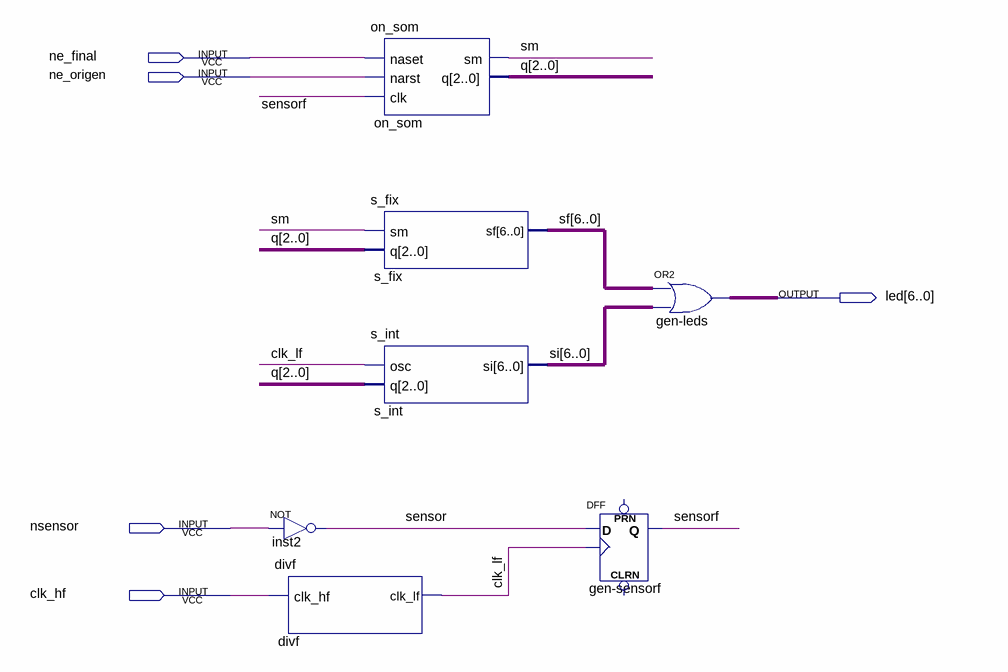
[diagram p0: schematic sheet]
// Quartus schematic metro7.bdf as structural Verilog: 7 symbols, 5 pins
module metro7 (
  input  ne_final,
  input  ne_origen,
  input  nsensor,
  input  clk_hf,
  output [6:0] led
);

  wire clk_lf, sensor, sensorf, sm;
  wire [2:0] q;
  wire [6:0] sf, si;

  not inst2 (sensor, nsensor);
  divf divf (.clk_hf(clk_hf), .clk_lf(clk_lf));
  on_som on_som (.naset(ne_final), .narst(ne_origen), .clk(sensorf), .sm(sm), .q(q));
  s_fix s_fix (.sm(sm), .q(q), .sf(sf));
  s_int s_int (.osc(clk_lf), .q(q), .si(si));
  DFF \gen-sensorf  (.CLK(clk_lf), .D(sensor), .Q(sensorf));  // open: CLRN, PRN
  assign led = sf | si;  // OR2 gen-leds, 7 bits wide
endmodule
